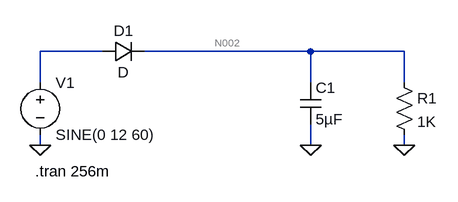
[diagram p0: schematic half_wave_rc.asc]
half_wave_rc.asc, the LTspice schematic file:
Version 4.1
SHEET 1 880 680
WIRE 192 96 96 96
WIRE 512 96 256 96
WIRE 656 96 512 96
WIRE 96 144 96 96
WIRE 512 144 512 96
WIRE 656 144 656 96
WIRE 96 240 96 224
WIRE 512 240 512 208
WIRE 656 240 656 224
FLAG 96 240 0
FLAG 512 240 0
FLAG 656 240 0
SYMBOL voltage 96 128 R0
WINDOW 123 0 0 Left 0
WINDOW 39 0 0 Left 0
SYMATTR InstName V1
SYMATTR Value SINE(0 12 60)
SYMBOL diode 192 112 R270
WINDOW 0 32 32 VTop 2
WINDOW 3 0 32 VBottom 2
SYMATTR InstName D1
SYMBOL res 640 128 R0
SYMATTR InstName R1
SYMATTR Value 1K
SYMBOL cap 496 144 R0
SYMATTR InstName C1
SYMATTR Value 5µF
TEXT 88 280 Left 2 !.tran 256m

The netlist it stands for:
* half_wave_rc.asc
V1 N001 0 SINE(0 12 60)
D1 N001 N002 D
R1 N002 0 1K
C1 N002 0 5µF
.model D D
.lib standard.dio
.tran 256m
.backanno
.end

* Results of the author's LTspice run, read from the files saved beside the schematic
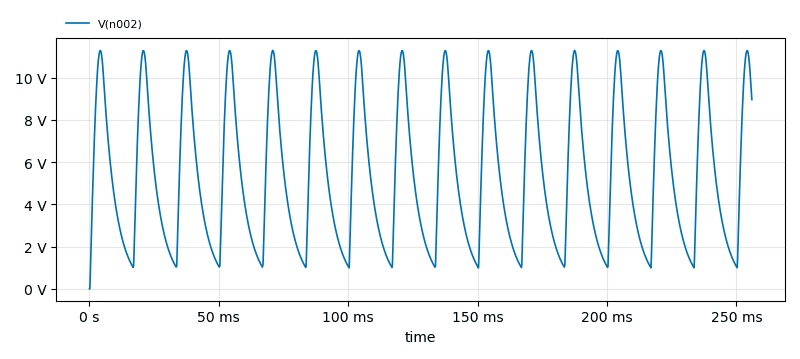
[diagram p1: Transient Analysis of half_wave_rc.asc, plotted from the saved traces]
* Transient Analysis, 1 run:
*   V(n002): min 0 V, max 11.29 V, average 5.326 V, rms 6.333 V, last 8.957 V